# Altium schematic sheet nrf52840.SchDoc
size 1651 x 1651 mm
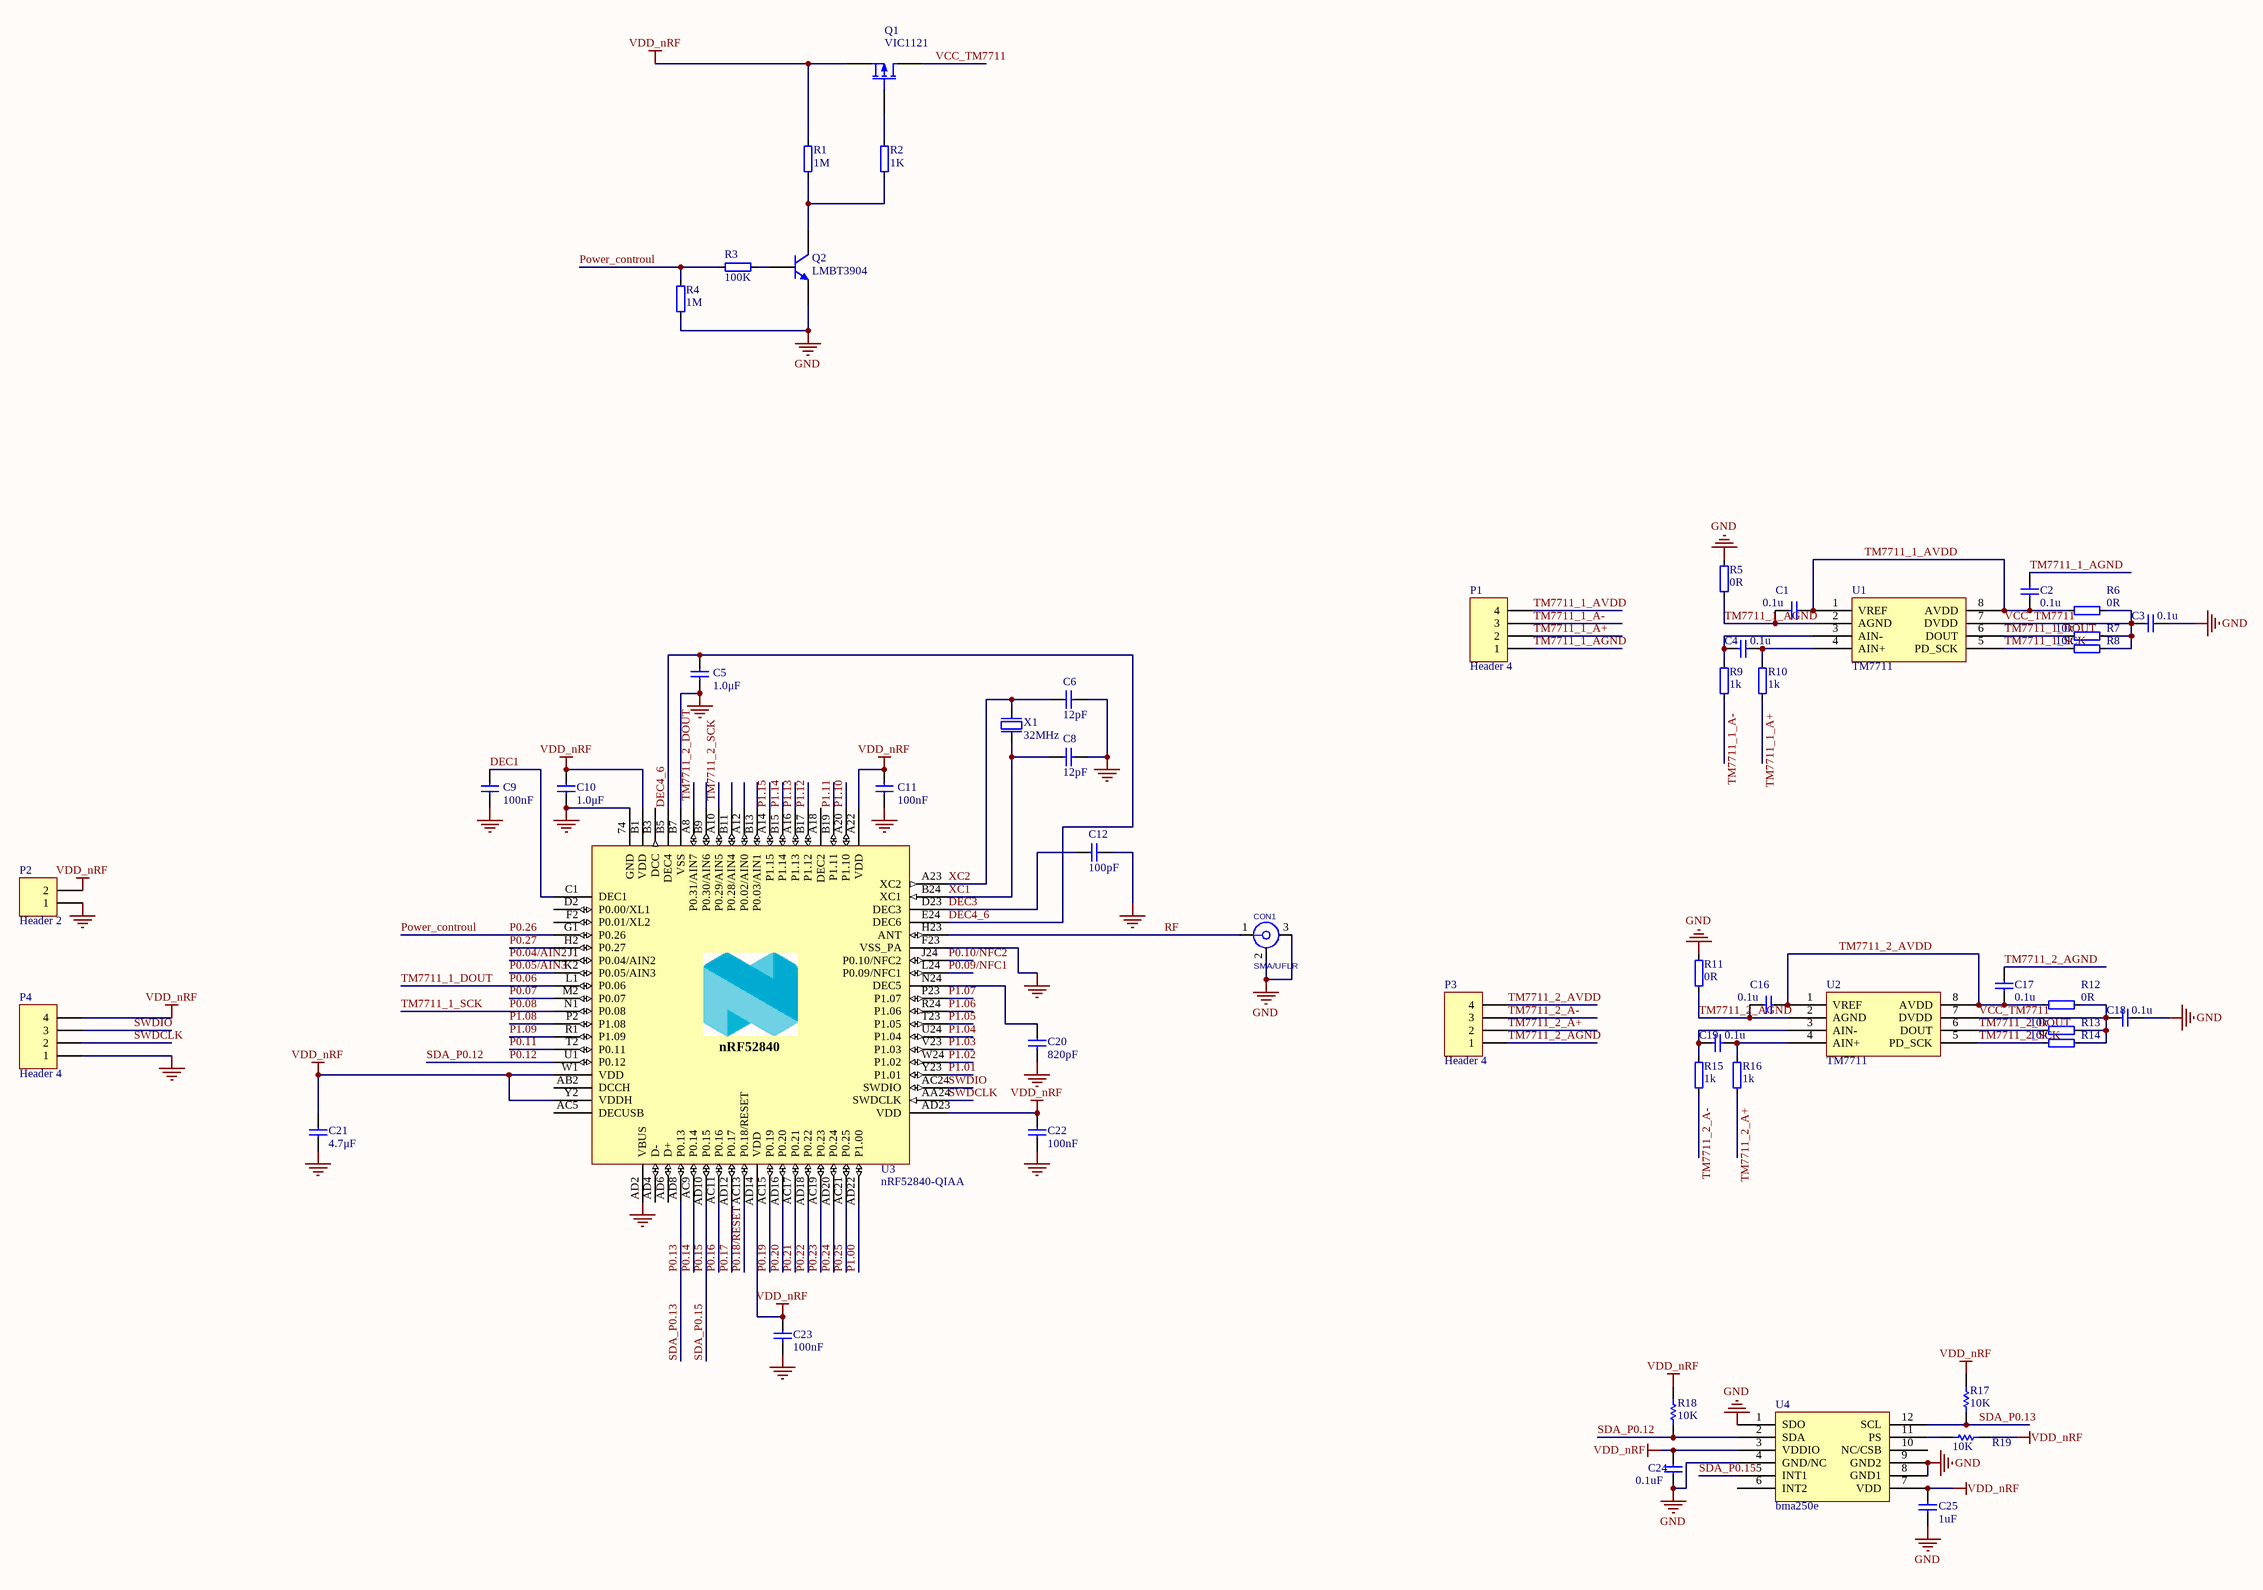
[diagram p0: nrf52840.SchDoc]

## Parts
C1  0.1u  [0402-a]
C2  0.1u  [0402-a]
C3  0.1u  [0402-a]
C4  0.1u  [0402-a]
C5  1.0μF  [0402-A]
C6  12pF  [0402-A]
C8  12pF  [0402-A]
C9  100nF  [0402-A]
C10  1.0μF  [0402-a]
C11  100nF  [0402-a]
C12  100pF  [0402-A]
C16  0.1u  [0402-a]
C17  0.1u  [0402-a]
C18  0.1u  [0402-a]
C19  0.1u  [0402-a]
C20  820pF  [0402-A]
C21  4.7μF  [0603-1]
C22  100nF  [0402-a]
C23  100nF  [0402-a]
C24  0.1uF  [0402-a]
C25  1uF  [0402-a]
CON1  SMA/UFLR  [IPX_U.FL]
P1  Header 4  [HDR1X4]
P2  Header 2  [BAT]
P3  Header 4  [HDR1X4]
P4  Header 4  [HDR1X4]
Q1  VIC1121  [SOT-23]
Q2  LMBT3904  [SOT523]
R1  1M  [0402-A]
R2  1K  [0402-A]
R3  100K  [0402-A]
R4  1M  [0402-A]
R5  0R  [0805-1]
R6  0R  [0805-1]
R7  10k  [0402-A]
R8  10k  [0402-A]
R9  1k  [0402-a]
R10  1k  [0402-a]
R11  0R  [0805-1]
R12  0R  [0805-1]
R13  10k  [0402-A]
R14  10k  [0402-A]
R15  1k  [0402-a]
R16  1k  [0402-a]
R17  10K  [0402-A]
R18  10K  [0402-A]
R19  10K  [0402-A]
U1  TM7711  [SO8_n]
U2  TM7711  [SO8_N]
U3  nRF52840-QIAA  [AQFN50P700X700X85_HS-74N]
U4  bma250e  [bma250e]
X1  32MHz  [SMD3225]

## Nets
GND: C3.2 C5.1 C6.2 C8.2 C9.2 C10.2 C11.2 C12.2 C18.2 C20.2 C21.2 C22.2 C23.2 C24.2 C25.1 CON1.2 CON1.3(GNDA) P2.1 P4.1 Q2.2(E) R4.1 R5.1 R11.1 U3.74(GND) U3.AD2(VBUS) U3.B7(VSS) U3.F23(VSS_PA) U4.1(SDO) U4.4(GND/NC) U4.8(GND1) U4.9(GND2) X1.2(GND) X1.4(GND)
VDD_nRF: C10.1 C11.1 C21.1 C22.1 C23.1 C24.1 C25.2 P2.2 P4.4 Q1.2(S) R1.2 R17.2 R18.2 R19.1 U3.A22(VDD) U3.AD14(VDD) U3.AD23(VDD) U3.B1(VDD) U3.W1(VDD) U3.Y2(VDDH) U4.3(VDDIO) U4.7(VDD)
DEC1: C9.1 U3.C1(DEC1)
DEC3: C12.1 U3.D23(DEC3)
DEC4_6: C5.2 U3.B5(DEC4) U3.E24(DEC6)
P0.04/AIN2: U3.J1(P0.04/AIN2)
P0.05/AIN3: U3.K2(P0.05/AIN3)
P0.06: R7.1 U1.6(DOUT) U3.L1(P0.06)  [also labelled TM7711_1_DOUT]
P0.07: U3.M2(P0.07)
P0.08: R8.1 U1.5(PD_SCK) U3.N1(P0.08)  [also labelled TM7711_1_SCK]
P0.09/NFC1: U3.L24(P0.09/NFC1)
P0.10/NFC2: U3.J24(P0.10/NFC2)
P0.11: U3.T2(P0.11)
P0.12: R18.1 U3.U1(P0.12) U4.2(SDA)  [also labelled SDA_P0.12]
P0.13: R17.1 U3.AD8(P0.13) U4.12(SCL)  [also labelled SDA_P0.13]
P0.14: U3.AC9(P0.14)
P0.15: U3.AD10(P0.15) U4.5(INT1)  [also labelled SDA_P0.15]
P0.16: U3.AC11(P0.16)
P0.17: U3.AD12(P0.17)
P0.18/RESET: U3.AC13(P0.18/RESET)
P0.19: U3.AC15(P0.19)
P0.20: U3.AD16(P0.20)
P0.21: U3.AC17(P0.21)
P0.22: U3.AD18(P0.22)
P0.23: U3.AC19(P0.23)
P0.24: U3.AD20(P0.24)
P0.25: U3.AC21(P0.25)
P0.26: R3.2 R4.2 U3.G1(P0.26)  [also labelled Power_controul]
P0.27: U3.H2(P0.27)
P1.00: U3.AD22(P1.00)
P1.01: U3.Y23(P1.01)
P1.02: U3.W24(P1.02)
P1.03: U3.V23(P1.03)
P1.04: U3.U24(P1.04)
P1.05: U3.T23(P1.05)
P1.06: U3.R24(P1.06)
P1.07: U3.P23(P1.07)
P1.08: U3.P2(P1.08)
P1.09: U3.R1(P1.09)
P1.10: U3.A20(P1.10)
P1.11: U3.B19(P1.11)
P1.12: U3.B17(P1.12)
P1.13: U3.A16(P1.13)
P1.14: U3.B15(P1.14)
P1.15: U3.A14(P1.15)
RF: CON1.1 U3.H23(ANT)
SWDCLK: P4.2 U3.AA24(SWDCLK)
SWDIO: P4.3 U3.AC24(SWDIO)
TM7711_1_A+: P1.2 R10.2
TM7711_1_A-: P1.3 R9.2
TM7711_1_AGND: C1.2 C2.2 P1.1 R5.2 U1.2(AGND)
TM7711_1_AVDD: C1.1 C2.1 P1.4 R6.2 U1.1(VREF) U1.8(AVDD)
TM7711_2_A+: P3.2 R16.2
TM7711_2_A-: P3.3 R15.2
TM7711_2_AGND: C16.2 C17.2 P3.1 R11.2 U2.2(AGND)
TM7711_2_AVDD: C16.1 C17.1 P3.4 R12.2 U2.1(VREF) U2.8(AVDD)
TM7711_2_DOUT: R13.1 U2.6(DOUT) U3.A8(P0.31/AIN7)
TM7711_2_SCK: R14.1 U2.5(PD_SCK) U3.A10(P0.29/AIN5)
VCC_TM7711: C3.1 C18.1 Q1.3(D) R6.1 R7.2 R8.2 R12.1 R13.2 R14.2 U1.7(DVDD) U2.7(DVDD)
XC1: C8.1 U3.B24(XC1) X1.1(inp)
XC2: C6.1 U3.A23(XC2) X1.3(out)
NetC4_1: C4.1 R9.1 U1.3(AIN-)
NetC4_2: C4.2 R10.1 U1.4(AIN+)
NetC19_1: C19.1 R15.1 U2.3(AIN-)
NetC19_2: C19.2 R16.1 U2.4(AIN+)
NetC20_1: C20.1 U3.N24(DEC5)
NetQ1_1: Q1.1(G) R2.2
NetQ2_1: Q2.1(B) R3.1
NetQ2_3: Q2.3(C) R1.1 R2.1
NetR19_2: R19.2 U4.11(PS)

Not connected (* = marked no-connect by the designer): U3 A12(P0.02/AIN0) A18(DEC2) AB2(DCCH) AC5(DECUSB) AD4(D-) AD6(D+) B3(DCC) B9(P0.30/AIN6) B11(P0.28/AIN4) B13(P0.03/AIN1) D2(P0.00/XL1) F2(P0.01/XL2); U4 6(INT2) 10(NC/CSB)

## Notes on the sheet
- (in symbol nRF52840-QIAAD0) nRF52840

## Library data of the parts
C1-C4 C16-C19 = C0402-N.C.: Not mounted; Value: N.C.; Assembly: Not mounted; Part Number: C0402-N.C.; LatestRevisionDate: 2009-05-08; Pin Count: 2; Publisher: Nordic Semiconductor; Published: 2009-05-08; Footprint Doc: 0402
C5 C10 = C0603-1?: Capacitor, X7R, ±10%; Part Number: C0603-1μ0; Note: 16V; LatestRevisionDate: 2013-06-05; Pin Count: 2; Publisher: Nordic Semiconductor; Published: 2009-05-08; Value: 1.0μF; Footprint Doc: 0603
C6 C8 = C0402-12p: Capacitor, NP0, ±2%; Note: 50V; Part Number: C0402-12p; LatestRevisionDate: 2011-05-11; Pin Count: 2; Publisher: Nordic Semiconductor; Published: 2009-05-08; Value: 12pF; Footprint Doc: 0402
C9 C11 C22 C23 = C0402-100n: Capacitor, X7R, ±10%; Note: 16V; Part Number: C0402-100n; LatestRevisionDate: 2009-11-23; Pin Count: 2; Publisher: Nordic Semiconductor; Published: 2009-05-08; Value: 100nF; Footprint Doc: 0402
C12 = C0402-100p: Capacitor, NP0, ±5%; Note: 50V; Part Number: C0402-100p; LatestRevisionDate: 2009-05-08; Pin Count: 2; Publisher: Nordic Semiconductor; Published: 2009-05-08; Value: 100pF; Footprint Doc: 0402
C20 = C0402-820p: Capacitor, NP0, ±5%; Note: 50V; Part Number: C0402-820p; LatestRevisionDate: 2009-05-08; Pin Count: 2; Publisher: Nordic Semiconductor; Published: 2009-05-08; Value: 820pF; Footprint Doc: 0402
C21 = C0603-4μ7-6.3: Capacitor, X7R, ±10%; Part Number: C0603-4μ7-6.3V-X7R; Note: 6.3V; LatestRevisionDate: 2015-06-10; Pin Count: 2; Publisher: Nordic Semiconductor; Published: 2015-06-10; Value: 4.7μF; Footprint Doc: 0603
C24 C25 = C0402-0.5p: Capacitor, NP0, ±10%; Value: 0.5pF; Note: 50V; Part Number: C0402-0.5p; LatestRevisionDate: 2017-02-23; Pin Count: 2; Publisher: Nordic Semiconductor; Published: 2009-05-08; Footprint Doc: 0402
CON1 = SMA/UFLR: Source_Path: D:\SCH\ORCAD\DANIEL\CONNECT.OLB; PCB DECAL: IPX_U.FL
P1 P3 P4 = Header 4: Header, 4-Pin; LatestRevisionDate: 17-Jul-2002; LatestRevisionNote: Re-released for DXP Platform.; Publisher: Altium Limited
P2 = Header 2: Header, 2-Pin; LatestRevisionDate: 17-Jul-2002; LatestRevisionNote: Re-released for DXP Platform.; Publisher: Altium Limited
Q1 = MOSFET-P: P-Channel MOSFET; PackageDocument: 1995/1996; Published: 8-Jun-2000; LatestRevisionDate: 17-Jul-2002; LatestRevisionNote: Re-released for DXP Platform.; PackageReference: E3; Publisher: Altium Limited
Q2 = 2N3904: NPN General Purpose Amplifier; Published: 8-Jun-2000; LatestRevisionDate: 15-Jan-2003; LatestRevisionNote: PCB Footprint 'BCY-W3/D4.7' replaced; DatasheetDocument: 1997; PackageDocument: Sep-1998; PackageReference: TO-92A; Publisher: Altium Limited; Code_JEDEC: TO-92A; ComponentLink1Description: Manufacturer Link; ComponentLink1URL: http://www.fairchildsemi.com/; ComponentLink2Description: Datasheet; ComponentLink2URL: http://www.fairchildsemi.com/ds/2N%2F2N3904.pdf
R1-R16 = R-10K: resistor
R17-R19 = Res1: Resistor; Published: 8-Jun-2000; LatestRevisionDate: 17-Jul-2002; LatestRevisionNote: Re-released for DXP Platform.; PackageReference: AXIAL-0.3; Publisher: Altium Limited; PackageDescription: Axial Device, Thru-Hole; 2 Leads; 0.3 in Pin Spacing
U3 = nRF52840-QIAAD0: Multi-protocol Bluetooth Low Energy, IEEE 802.15.4, ANT and 2.4GHz proprietary system-on-chip; Manufacturer: Nordic Semiconductor; Part Number: nRF52840-QIAAD0; LatestRevisionDate: 2018-12-04; Pin Count: 73; Publisher: Nordic Semiconductor; Published: 2018-12-04; Value: nRF52840-QIAA; Note: *; Footprint Doc: AQFN-73; Manufacturer Part Number: nRF52840-QIAAD0
X1 = XTAL_SMD2016_32MHz_8pF_General: XTAL SMD 2016, 32MHz, Cl=8pF, Total Tol: ±40ppm; Part Number: XTAL_SMD2016_32MHz_8pF_General; LatestRevisionDate: 2016-08-19; Pin Count: 4; Publisher: Nordic Semiconductor; Published: 2016-08-19; Value: 32MHz; Footprint Doc: XTAL_2016